# Altium schematic sheet OK10xx_S V1.1.SchDoc
size A3; Revision: 1.0; SheetNumber: 2; SheetTotal: 7
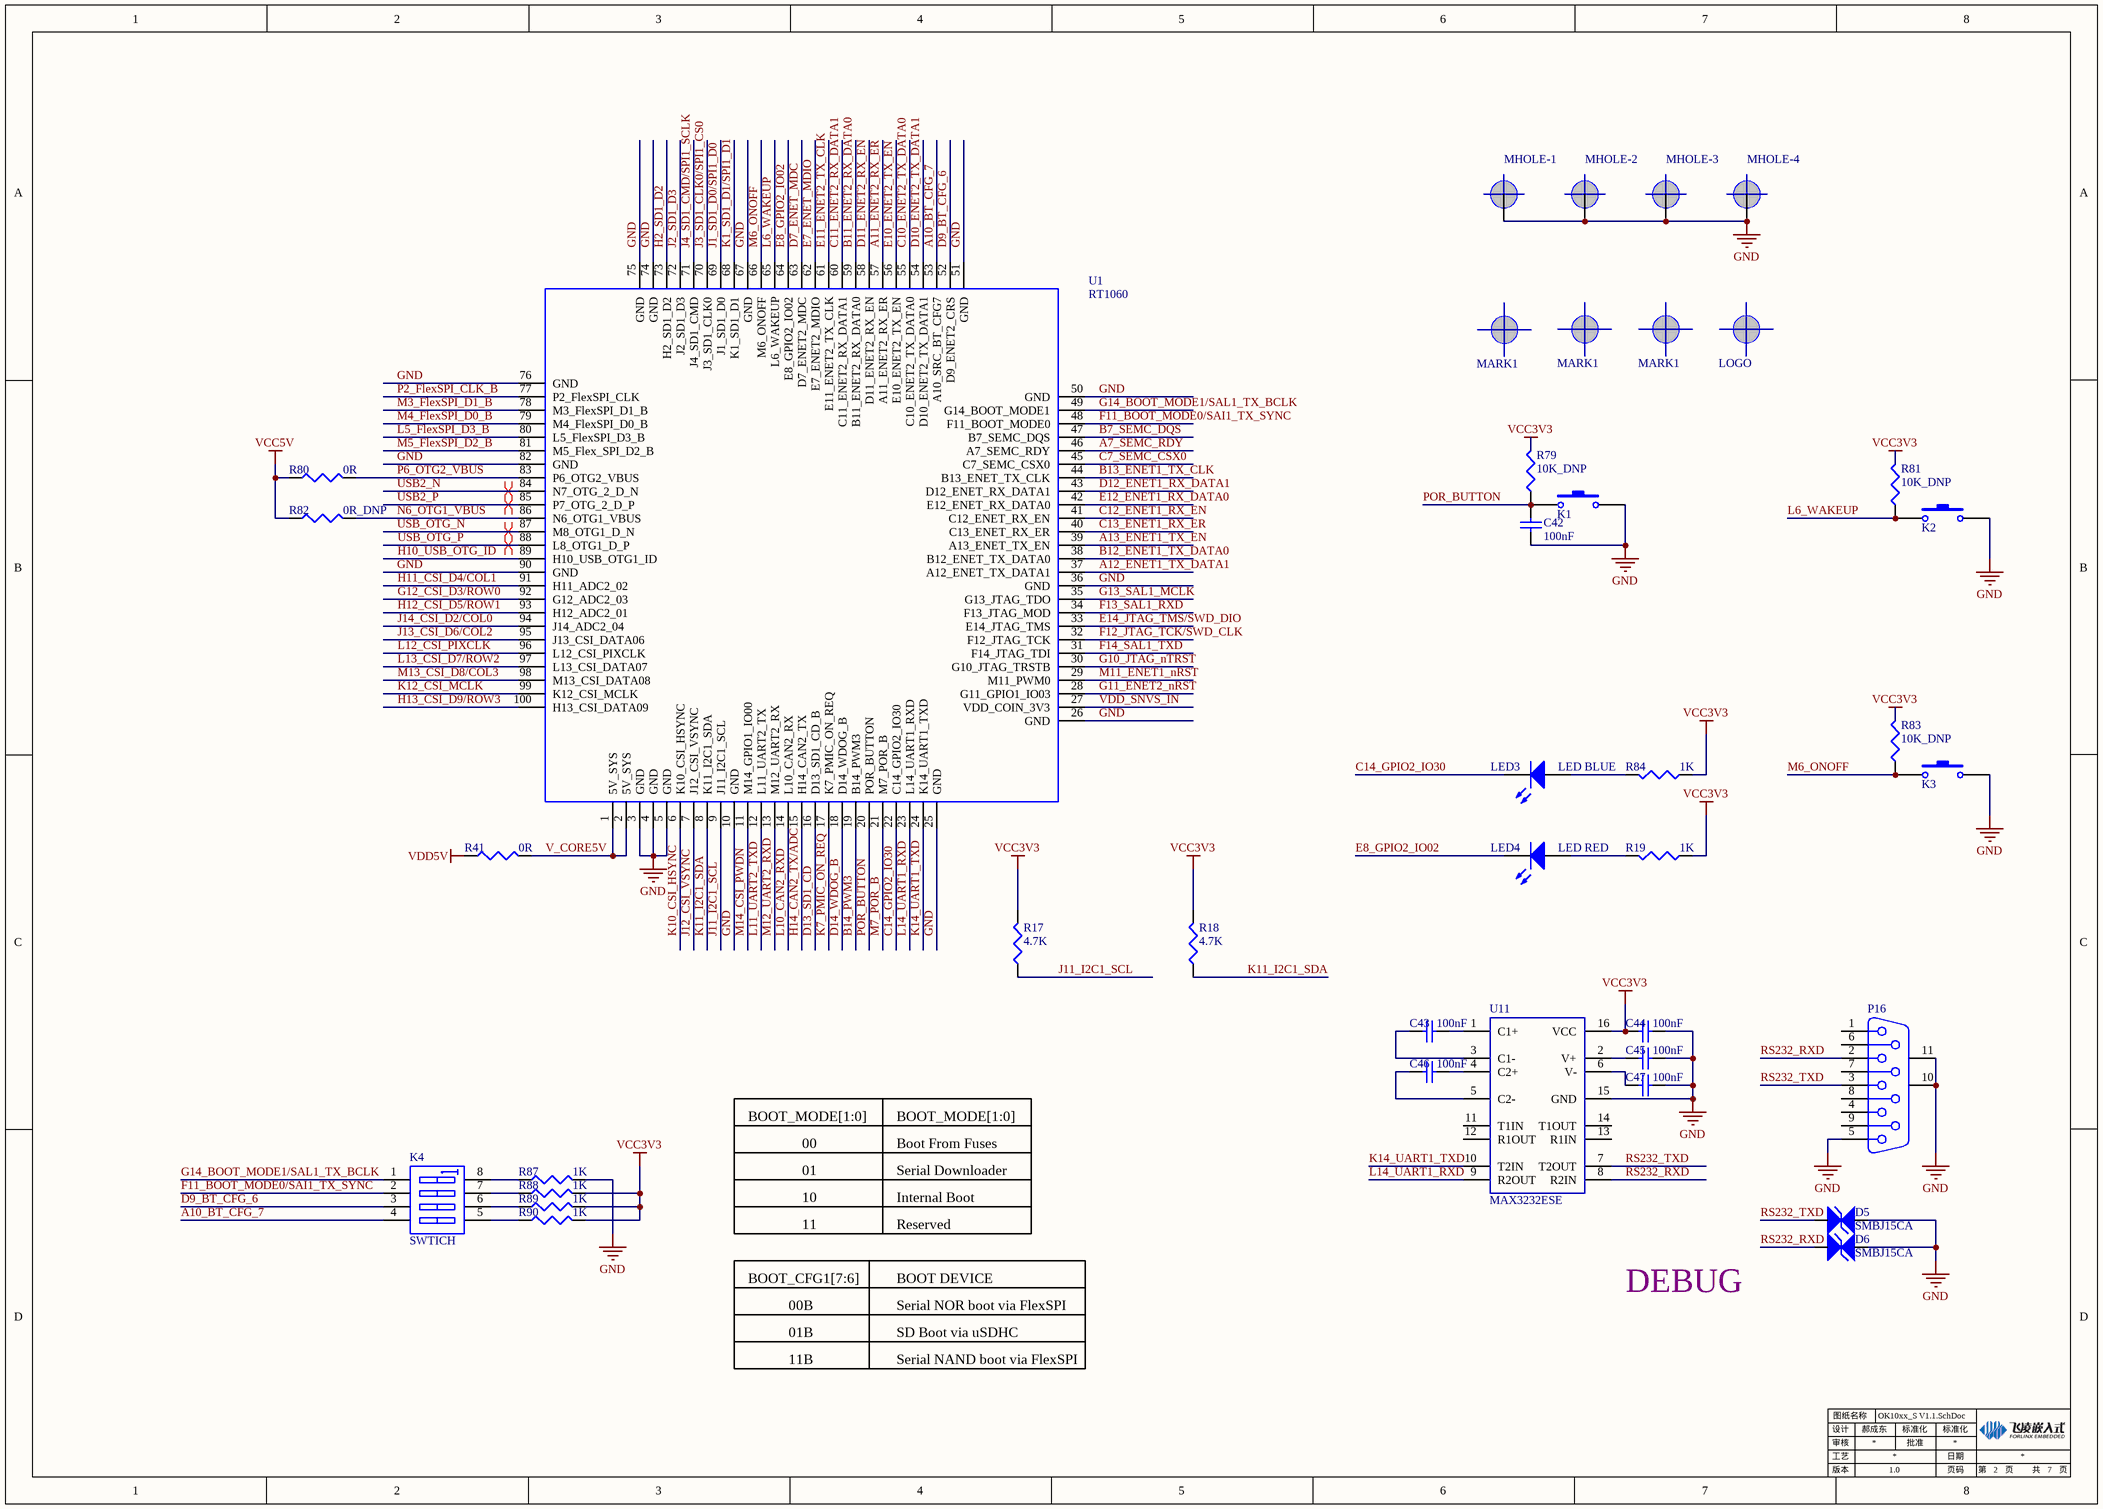
[diagram p0: OK10xx_S V1.1.SchDoc]

## Parts
C42  100nF  [0603C+]
C43  100nF  [0603C+]
C44  100nF  [0603C+]
C45  100nF  [0603C+]
C46  100nF  [0603C+]
C47  100nF  [0603C+]
D5  SMBJ15CA  [SMB/DO-214AA]
D6  SMBJ15CA  [SMB/DO-214AA]
K1  6*6*5侧位2脚带支架  [SW-01]  (value not drawn)
K2  6*6*5侧位2脚带支架  [SW-01]  (value not drawn)
K3  6*6*5侧位2脚带支架  [SW-01]  (value not drawn)
K4  SWTICH  [SMD_4]
LED3  BOOK: LED BLUE  [LED0603_M1608]  (hidden comment: LED_BULE)
LED4  BOOK: LED RED  [LED0603_M1608]  (hidden comment: LED_BULE)
LOGO1  LOGO  [LOGO]
M1  MHOLE-1  [3.2mm_hole]
M2  MHOLE-2  [3.2mm_hole]
M3  MHOLE-3  [3.2mm_hole]
M4  MHOLE-4  [3.2mm_hole]
Mark1  MARK1  [MARK POINT]
Mark2  MARK1  [MARK POINT]
Mark3  MARK1  [MARK POINT]
P16  DEBUG  [DSUB1.385-2H9-M]  (value not drawn)
R17  4.7K  [0603R+]
R18  4.7K  [0603R+]
R19  1K  [0603R+]
R41  0R  [R_1210]
R79  10K_DNP  [0603R+]
R80  0R  [0603R+]
R81  10K_DNP  [0603R+]
R82  0R_DNP  [0603R+]
R83  10K_DNP  [0603R+]
R84  1K  [0603R+]
R87  1K  [0603R+]
R88  1K  [0603R+]
R89  1K  [0603R+]
R90  1K  [0603R+]
U1  RT1060
U11  MAX3232ESE  [SOIC-16N]

## Nets
GND: C42.1 C44.2 C45.2 C47.2 D5.2 D6.2 K1.2 K2.2 K3.2 M1.1(EF) M2.1(EF) M3.1(EF) M4.1(EF) P16.5 P16.10(MH1) P16.11(MH2) R87.2 U1.3(GND) U1.4(GND) U1.5(GND) U1.10(GND) U1.25(GND) U1.26(GND) U1.36(GND) U1.50(GND) U1.51(GND) U1.67(GND) U1.74(GND) U1.75(GND) U1.76(GND) U1.82(GND) U1.90(GND) U11.15(GND)
VCC3V3: C44.1 R17.2 R18.2 R19.1 R79.2 R81.2 R83.2 R84.1 R88.2 R89.2 R90.2 U11.16(VCC)
VCC5V: R80.1 R82.1
VDD5V: R41.1
A7_SEMC_RDY: U1.46(A7_SEMC_RDY)
A10_BT_CFG_7: K4.4(A4) U1.53(A10_SRC_BT_CFG7)
A11_ENET2_RX_ER: U1.57(A11_ENET2_RX_ER)
A12_ENET1_TX_DATA1: U1.37(A12_ENET_TX_DATA1)
A13_ENET1_TX_EN: U1.39(A13_ENET_TX_EN)
B7_SEMC_DQS: U1.47(B7_SEMC_DQS)
B11_ENET2_RX_DATA0: U1.59(B11_ENET2_RX_DATA0)
B12_ENET1_TX_DATA0: U1.38(B12_ENET_TX_DATA0)
B13_ENET1_TX_CLK: U1.44(B13_ENET_TX_CLK)
B14_PWM3: U1.19(B14_PWM3)
C7_SEMC_CSX0: U1.45(C7_SEMC_CSX0)
C10_ENET2_TX_DATA0: U1.55(C10_ENET2_TX_DATA0)
C11_ENET2_RX_DATA1: U1.60(C11_ENET2_RX_DATA1)
C12_ENET1_RX_EN: U1.41(C12_ENET_RX_EN)
C13_ENET1_RX_ER: U1.40(C13_ENET_RX_ER)
C14_GPIO2_IO30: LED3.2(K) U1.22(C14_GPIO2_IO30)
D7_ENET_MDC: U1.63(D7_ENET2_MDC)
D9_BT_CFG_6: K4.3(A3) U1.52(D9_ENET2_CRS)
D10_ENET2_TX_DATA1: U1.54(D10_ENET2_TX_DATA1)
D11_ENET2_RX_EN: U1.58(D11_ENET2_RX_EN)
D12_ENET1_RX_DATA1: U1.43(D12_ENET_RX_DATA1)
D13_SD1_CD: U1.16(D13_SD1_CD_B)
D14_WDOG_B: U1.18(D14_WDOG_B)
E7_ENET_MDIO: U1.62(E7_ENET2_MDIO)
E8_GPIO2_IO02: LED4.2(K) U1.64(E8_GPIO2_IO02)
E10_ENET2_TX_EN: U1.56(E10_ENET2_TX_EN)
E11_ENET2_TX_CLK: U1.61(E11_ENET2_TX_CLK)
E12_ENET1_RX_DATA0: U1.42(E12_ENET_RX_DATA0)
E14_JTAG_TMS/SWD_DIO: U1.33(E14_JTAG_TMS)
F11_BOOT_MODE0/SAI1_TX_SYNC: K4.2(A2) U1.48(F11_BOOT_MODE0)
F12_JTAG_TCK/SWD_CLK: U1.32(F12_JTAG_TCK)
F13_SAL1_RXD: U1.34(F13_JTAG_MOD)
F14_SAL1_TXD: U1.31(F14_JTAG_TDI)
G10_JTAG_nTRST: U1.30(G10_JTAG_TRSTB)
G11_ENET2_nRST: U1.28(G11_GPIO1_IO03)
G12_CSI_D3/ROW0: U1.92(G12_ADC2_03)
G13_SAL1_MCLK: U1.35(G13_JTAG_TDO)
G14_BOOT_MODE1/SAL1_TX_BCLK: K4.1(A1) U1.49(G14_BOOT_MODE1)
H2_SD1_D2: U1.73(H2_SD1_D2)
H10_USB_OTG_ID: U1.89(H10_USB_OTG1_ID)
H11_CSI_D4/COL1: U1.91(H11_ADC2_02)
H12_CSI_D5/ROW1: U1.93(H12_ADC2_01)
H13_CSI_D9/ROW3: U1.100(H13_CSI_DATA09)
H14_CAN2_TX/ADC: U1.15(H14_CAN2_TX)
J1_SD1_D0/SPI1_D0: U1.69(J1_SD1_D0)
J2_SD1_D3: U1.72(J2_SD1_D3)
J3_SD1_CLK0/SPI1_CS0: U1.70(J3_SD1_CLK0)
J4_SD1_CMD/SPI1_SCLK: U1.71(J4_SD1_CMD)
J11_I2C1_SCL: R17.1 U1.9(J11_I2C1_SCL)
J12_CSI_VSYNC: U1.7(J12_CSI_VSYNC)
J13_CSI_D6/COL2: U1.95(J13_CSI_DATA06)
J14_CSI_D2/COL0: U1.94(J14_ADC2_04)
K1_SD1_D1/SPI1_D1: U1.68(K1_SD1_D1)
K7_PMIC_ON_REQ: U1.17(K7_PMIC_ON_REQ)
K10_CSI_HSYNC: U1.6(K10_CSI_HSYNC)
K11_I2C1_SDA: R18.1 U1.8(K11_I2C1_SDA)
K12_CSI_MCLK: U1.99(K12_CSI_MCLK)
K14_UART1_TXD: U1.24(K14_UART1_TXD) U11.10(T2IN)
L5_FlexSPI_D3_B: U1.80(L5_FlexSPI_D3_B)
L6_WAKEUP: K2.1 R81.1 U1.65(L6_WAKEUP)
L10_CAN2_RXD: U1.14(L10_CAN2_RX)
L11_UART2_TXD: U1.12(L11_UART2_TX)
L12_CSI_PIXCLK: U1.96(L12_CSI_PIXCLK)
L13_CSI_D7/ROW2: U1.97(L13_CSI_DATA07)
L14_UART1_RXD: U1.23(L14_UART1_RXD) U11.9(R2OUT)
M3_FlexSPI_D1_B: U1.78(M3_FlexSPI_D1_B)
M4_FlexSPI_D0_B: U1.79(M4_FlexSPI_D0_B)
M5_FlexSPI_D2_B: U1.81(M5_Flex_SPI_D2_B)
M6_ONOFF: K3.1 R83.1 U1.66(M6_ONOFF)
M7_POR_B: U1.21(M7_POR_B)
M11_ENET1_nRST: U1.29(M11_PWM0)
M12_UART2_RXD: U1.13(M12_UART2_RX)
M13_CSI_D8/COL3: U1.98(M13_CSI_DATA08)
M14_CSI_PWDN: U1.11(M14_GPIO1_IO00)
N6_OTG1_VBUS: R82.2 U1.86(N6_OTG1_VBUS)
P2_FlexSPI_CLK_B: U1.77(P2_FlexSPI_CLK)
P6_OTG2_VBUS: R80.2 U1.83(P6_OTG2_VBUS)
POR_BUTTON: C42.2 K1.1 R79.1 U1.20(POR_BUTTON)
RS232_RXD: D6.1 P16.2 U11.8(R2IN)
RS232_TXD: D5.1 P16.3 U11.7(T2OUT)
USB2_N: U1.84(N7_OTG_2_D_N)
USB2_P: U1.85(P7_OTG_2_D_P)
USB_OTG_N: U1.87(M8_OTG1_D_N)
USB_OTG_P: U1.88(L8_OTG1_D_P)
V_CORE5V: R41.2 U1.1(5V_SYS) U1.2(5V_SYS)
VDD_SNVS_IN: U1.27(VDD_COIN_3V3)
NetC43_1: C43.1 U11.3(C1-)
NetC43_2: C43.2 U11.1(C1+)
NetC45_1: C45.1 U11.2(V+)
NetC46_1: C46.1 U11.5(C2-)
NetC46_2: C46.2 U11.4(C2+)
NetC47_1: C47.1 U11.6(V-)
NetK4_5: K4.5(B4) R90.1
NetK4_6: K4.6(B3) R89.1
NetK4_7: K4.7(B2) R88.1
NetK4_8: K4.8(B1) R87.1
NetLED3_1: LED3.1(A) R84.2
NetLED4_1: LED4.1(A) R19.2

Not connected (* = marked no-connect by the designer): P16 1 4 6 7 8 9; U11 11(T1IN) 12(R1OUT) 13(R1IN) 14(T1OUT)

## Layout directives
differential pair: USB2_N, USB2_P, USB_OTG_N, USB_OTG_P

## Notes on the sheet
- BOOT_MODE[1:0]
- 00
- 01
- Boot From Fuses
- Serial Downloader
- 10
- 11
- Internal Boot
- Reserved
- BOOT_CFG1[7:6]
- 00B
- BOOT DEVICE
- Serial NOR boot via FlexSPI
- DEBUG
- 01B
- 11B
- SD Boot via uSDHC
- Serial NAND boot via FlexSPI
- 设计
- 审核
- 工艺
- 图纸名称
- 郝成东
- 批准
- 标准化
- 日期
- 版本
- 页码
- 第
- 页
- 共

## Library data of the parts
C42-C47 = Cap: Capacitor; Published: 8-Jun-2000; LatestRevisionDate: 17-Jul-2002; LatestRevisionNote: Re-released for DXP Platform.; PackageReference: RAD-0.3; Publisher: Altium Limited; PackageDescription: Radial Cap, Thru-Hole; 2 Leads; 0.3 in Pin Spacing; Value: 100nF
D5 D6 = TVS: Value: SMBJ15CA
K1-K3 = SW-PB: Switch; Published: 24-Mar-1999; LatestRevisionDate: 17-Jul-2002; LatestRevisionNote: Re-released for DXP Platform.; PackageReference: SPST-2; Publisher: Altium Limited
K4 = SWTICH_DIP6
LED3 LED4 = LED2: Typical RED, GREEN, YELLOW, AMBER GaAs LED; Published: 8-Jun-2000; LatestRevisionDate: 17-Jul-2002; LatestRevisionNote: Re-released for DXP Platform.; PackageDocument: Feb-2002; PackageReference: 3.2X1.6X1.1; Publisher: Altium Limited
LOGO1 = MHOLE_1
M1 M3 M4 = MHOLE-2
Mark1-Mark3 = MHOLE
P16 = D Connector 9: Receptacle Assembly, 9 Position, Right Angle; PackageDocument: O; Positions: 9; Published: 15-Jun-2001; LatestRevisionDate: 17-Jul-2002; LatestRevisionNote: Re-released for DXP Platform.; DatasheetDocument: 1-Sep-1999; PackageReference: 788750; Publisher: Altium Limited; Orientation: Right Angle; Gender: Receptacle
R17-R19 R41 R79-R84 R87-R90 = Res3: Resistor; Published: 8-Jun-2000; LatestRevisionDate: 29-May-2009; LatestRevisionNote: IPC-7351 Footprint Added.; PackageReference: J1-0603; Publisher: Altium Limited; PackageDescription: Chip Resistor
  R17 R18: Value: 4.7K
  R19 R84 R87-R90: Value: 1K
  R41 R80: Value: 0R
  R79 R81 R83: Value: 10K_DNP
  R82: Value: 0R_DNP
U11 = MAX3232